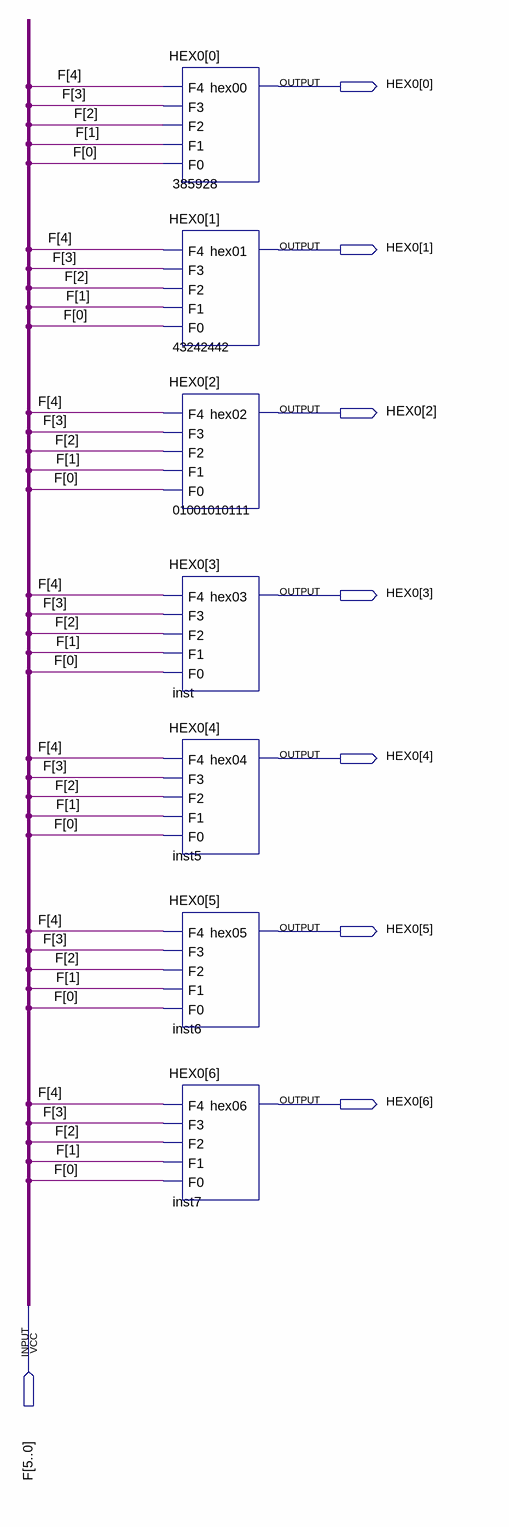
[diagram p0: schematic sheet]
// Quartus schematic Display_7_segmentos_F.bdf as structural Verilog: 7 symbols, 8 pins
module Display_7_segmentos_F (
  input  [5:0] F,
  output [6:0] HEX0
);

  \HEX0[0]  u_385928 (.F4(F[4]), .F3(F[3]), .F2(F[2]), .F1(F[1]), .F0(F[0]), .hex00(HEX0[0]));
  \HEX0[1]  u_43242442 (.F4(F[4]), .F3(F[3]), .F2(F[2]), .F1(F[1]), .F0(F[0]), .hex01(HEX0[1]));
  \HEX0[2]  u_01001010111 (.F4(F[4]), .F3(F[3]), .F2(F[2]), .F1(F[1]), .F0(F[0]), .hex02(HEX0[2]));
  \HEX0[3]  inst (.F4(F[4]), .F3(F[3]), .F2(F[2]), .F1(F[1]), .F0(F[0]), .hex03(HEX0[3]));
  \HEX0[4]  inst5 (.F4(F[4]), .F3(F[3]), .F2(F[2]), .F1(F[1]), .F0(F[0]), .hex04(HEX0[4]));
  \HEX0[5]  inst6 (.F4(F[4]), .F3(F[3]), .F2(F[2]), .F1(F[1]), .F0(F[0]), .hex05(HEX0[5]));
  \HEX0[6]  inst7 (.F4(F[4]), .F3(F[3]), .F2(F[2]), .F1(F[1]), .F0(F[0]), .hex06(HEX0[6]));
endmodule
